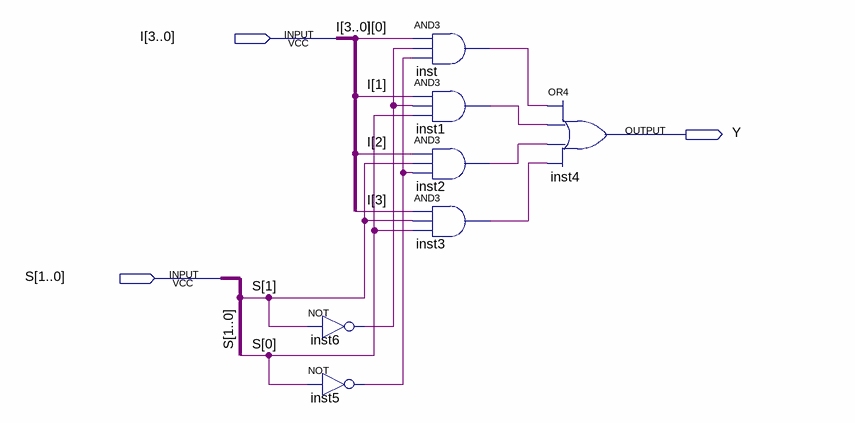
[diagram p0: schematic sheet]
// Quartus schematic fouroneMUX.bdf as structural Verilog: 7 symbols, 3 pins
module fouroneMUX (
  input  [3:0] I,
  input  [1:0] S,
  output Y
);

  wire inst1_out, inst2_out, inst3_out, inst5_out, inst6_out, inst_out;

  not inst6 (inst6_out, S[1]);
  not inst5 (inst5_out, S[0]);
  and inst (inst_out, I[0], inst6_out, inst5_out);
  and inst1 (inst1_out, I[1], inst6_out, S[0]);
  and inst2 (inst2_out, I[2], S[1], inst5_out);
  and inst3 (inst3_out, I[3], S[1], S[0]);
  or inst4 (Y, inst_out, inst1_out, inst2_out, inst3_out);
endmodule
